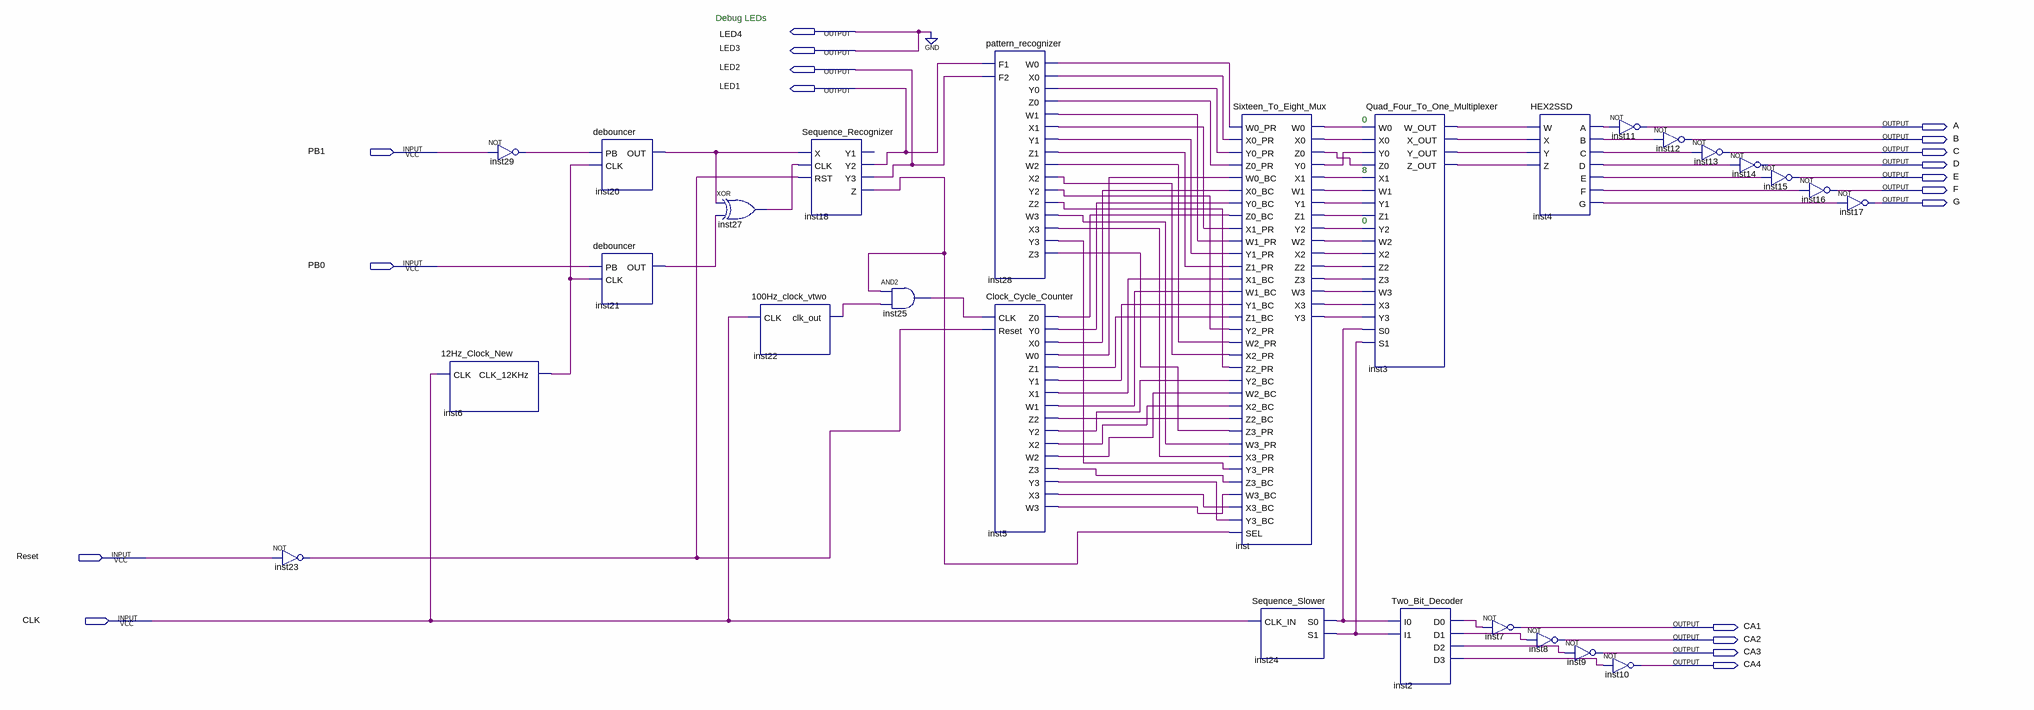
[diagram p0: schematic sheet]
// Quartus schematic LAB_3.bdf as structural Verilog: 27 symbols, 19 pins
module LAB_3 (
  input  PB1,
  input  PB0,
  input  Reset,
  input  CLK,
  output LED4,
  output LED3,
  output LED2,
  output LED1,
  output A,
  output B,
  output C,
  output D,
  output E,
  output F,
  output G,
  output CA1,
  output CA2,
  output CA3,
  output CA4
);

  wire inst2_d0, inst2_d1, inst2_d2, inst2_d3, inst3_w_out, inst3_x_out, inst3_y_out, inst3_z_out, inst4_a,
       inst4_b, inst4_c, inst4_d, inst4_e, inst4_f, inst4_g, inst5_w0, inst5_w1, inst5_w2, inst5_w3,
       inst5_x0, inst5_x1, inst5_x2, inst5_x3, inst5_y0, inst5_y1, inst5_y2, inst5_y3, inst5_z0, inst5_z1,
       inst5_z2, inst5_z3, inst6_clk_12khz, inst18_z, inst20_out, inst21_out, inst22_clk_out, inst23_out,
       inst24_s0, inst24_s1, inst25_out, inst27_out, inst28_w0, inst28_w1, inst28_w2, inst28_w3, inst28_x0,
       inst28_x1, inst28_x2, inst28_x3, inst28_y0, inst28_y1, inst28_y2, inst28_y3, inst28_z0, inst28_z1,
       inst28_z2, inst28_z3, inst29_out, inst_w0, inst_w1, inst_w2, inst_w3, inst_x0, inst_x1, inst_x2,
       inst_x3, inst_y0, inst_y1, inst_y2, inst_y3, inst_z0, inst_z1, inst_z2, inst_z3;

  not inst23 (inst23_out, Reset);
  \12Hz_Clock_New  inst6 (.CLK(CLK), .CLK_12KHz(inst6_clk_12khz));
  not inst29 (inst29_out, PB1);
  debouncer inst20 (.PB(inst29_out), .CLK(inst6_clk_12khz), .OUT(inst20_out));
  debouncer inst21 (.PB(PB0), .CLK(inst6_clk_12khz), .OUT(inst21_out));
  xor inst27 (inst27_out, inst20_out, inst21_out);
  \100Hz_clock_vtwo  inst22 (.CLK(CLK), .clk_out(inst22_clk_out));
  Sequence_Recognizer inst18 (
    .X(inst20_out), .CLK(inst27_out), .RST(inst23_out), .Y2(LED1), .Y3(LED2), .Z(inst18_z));  // open: Y1
  and inst25 (inst25_out, inst18_z, inst22_clk_out);
  pattern_recognizer inst28 (
    .F1(LED1), .F2(LED2), .W0(inst28_w0), .X0(inst28_x0), .Y0(inst28_y0), .Z0(inst28_z0), .W1(inst28_w1),
    .X1(inst28_x1), .Y1(inst28_y1), .Z1(inst28_z1), .W2(inst28_w2), .X2(inst28_x2), .Y2(inst28_y2),
    .Z2(inst28_z2), .W3(inst28_w3), .X3(inst28_x3), .Y3(inst28_y3), .Z3(inst28_z3));
  Clock_Cycle_Counter inst5 (
    .CLK(inst25_out), .Reset(inst23_out), .Z0(inst5_z0), .Y0(inst5_y0), .X0(inst5_x0), .W0(inst5_w0),
    .Z1(inst5_z1), .Y1(inst5_y1), .X1(inst5_x1), .W1(inst5_w1), .Z2(inst5_z2), .Y2(inst5_y2), .X2(inst5_x2),
    .W2(inst5_w2), .Z3(inst5_z3), .Y3(inst5_y3), .X3(inst5_x3), .W3(inst5_w3));
  Sixteen_To_Eight_Mux inst (
    .W0_PR(inst28_w0), .X0_PR(inst28_x0), .Y0_PR(inst28_y0), .Z0_PR(inst28_z0), .W0_BC(inst5_w0),
    .X0_BC(inst5_x0), .Y0_BC(inst5_y0), .Z0_BC(inst5_z0), .X1_PR(inst28_x1), .W1_PR(inst28_w1),
    .Y1_PR(inst28_y1), .Z1_PR(inst28_z1), .X1_BC(inst5_x1), .W1_BC(inst5_w1), .Y1_BC(inst5_y1),
    .Z1_BC(inst5_z1), .Y2_PR(inst28_y2), .W2_PR(inst28_w2), .X2_PR(inst28_x2), .Z2_PR(inst28_z2),
    .Y2_BC(inst5_y2), .W2_BC(inst5_w2), .X2_BC(inst5_x2), .Z2_BC(inst5_z2), .Z3_PR(inst28_z3),
    .W3_PR(inst28_w3), .X3_PR(inst28_x3), .Y3_PR(inst28_y3), .Z3_BC(inst5_z3), .W3_BC(inst5_w3),
    .X3_BC(inst5_x3), .Y3_BC(inst5_y3), .SEL(inst18_z), .W0(inst_w0), .X0(inst_x0), .Z0(inst_z0),
    .Y0(inst_y0), .X1(inst_x1), .W1(inst_w1), .Y1(inst_y1), .Z1(inst_z1), .Y2(inst_y2), .W2(inst_w2),
    .X2(inst_x2), .Z2(inst_z2), .Z3(inst_z3), .W3(inst_w3), .X3(inst_x3), .Y3(inst_y3));
  Sequence_Slower inst24 (.CLK_IN(CLK), .S0(inst24_s0), .S1(inst24_s1));
  Quad_Four_To_One_Multiplexer inst3 (
    .W0(inst_w0), .X0(inst_x0), .Y0(inst_y0), .Z0(inst_z0), .X1(inst_x1), .W1(inst_w1), .Y1(inst_y1),
    .Z1(inst_z1), .Y2(inst_y2), .W2(inst_w2), .X2(inst_x2), .Z2(inst_z2), .Z3(inst_z3), .W3(inst_w3),
    .X3(inst_x3), .Y3(inst_y3), .S0(inst24_s0), .S1(inst24_s1), .W_OUT(inst3_w_out), .X_OUT(inst3_x_out),
    .Y_OUT(inst3_y_out), .Z_OUT(inst3_z_out));
  Two_Bit_Decoder inst2 (.I0(inst24_s0), .I1(inst24_s1), .D0(inst2_d0), .D1(inst2_d1), .D2(inst2_d2), .D3(inst2_d3));
  not inst7 (CA1, inst2_d0);
  HEX2SSD inst4 (
    .W(inst3_w_out), .X(inst3_x_out), .Y(inst3_y_out), .Z(inst3_z_out), .A(inst4_a), .B(inst4_b),
    .C(inst4_c), .D(inst4_d), .E(inst4_e), .F(inst4_f), .G(inst4_g));
  not inst8 (CA2, inst2_d1);
  not inst9 (CA3, inst2_d2);
  not inst11 (A, inst4_a);
  not inst10 (CA4, inst2_d3);
  not inst12 (B, inst4_b);
  not inst13 (C, inst4_c);
  not inst14 (D, inst4_d);
  not inst15 (E, inst4_e);
  not inst16 (F, inst4_f);
  not inst17 (G, inst4_g);

  assign LED3 = 1'b0;
  assign LED4 = 1'b0;

  // Notes on the sheet:
  //   Debug LEDs
  //   0
  //   8
  //   0
endmodule
